# EasyEDA schematic 1-Schematic_Cowboy-key.json
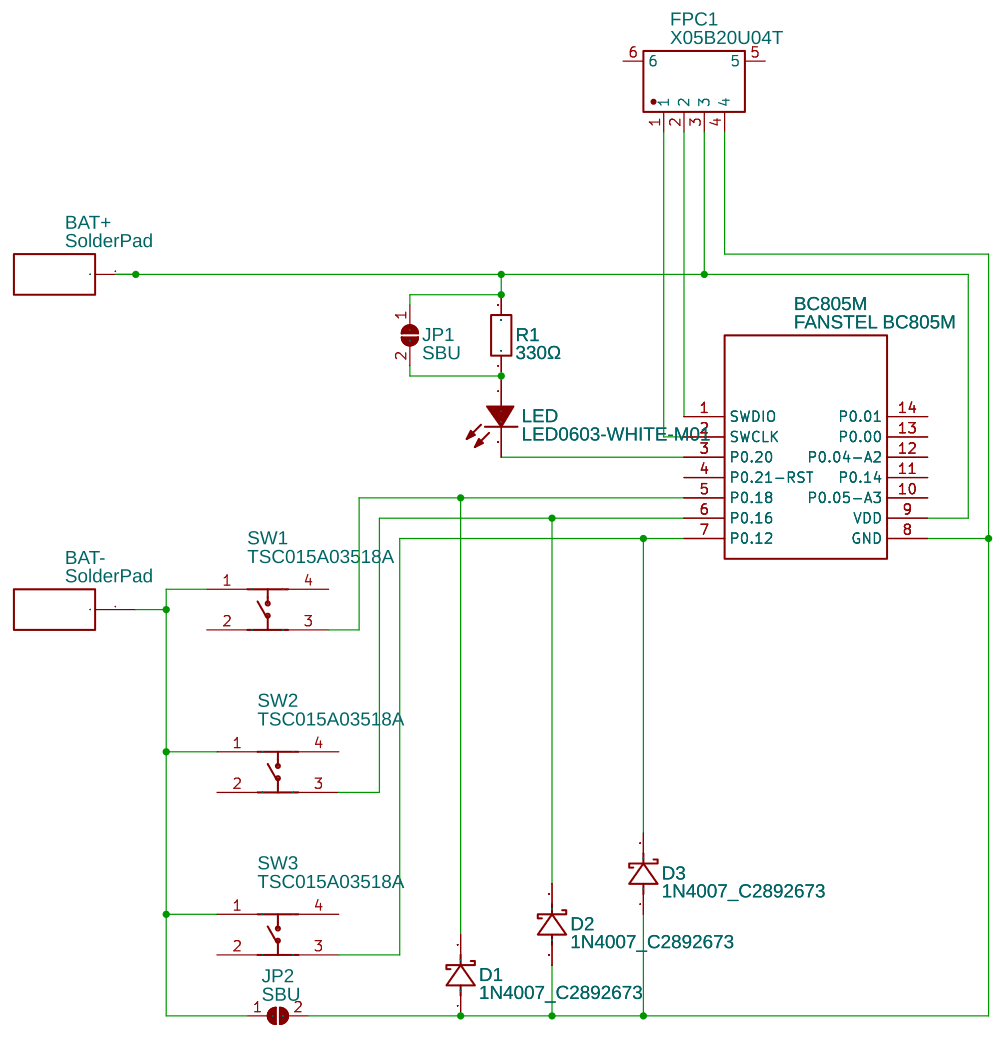
[diagram p0: schematic sheet]

## Parts
BAT+  SolderPad  [SOLDERPAD]
BAT-  SolderPad  [SOLDERPAD]
BC805M  FANSTEL BC805M  [FANSTEL BC805M]
D1  1N4007_C2892673  [SMA_L4.3-W2.6-LS5.1-R-RD]
D2  1N4007_C2892673  [SMA_L4.3-W2.6-LS5.1-R-RD]
D3  1N4007_C2892673  [SMA_L4.3-W2.6-LS5.1-R-RD]
FPC1  X05B20U04T  [FFC-SMD_4P-P0.50_X05B20U04T]
JP1  SBU  [SOLDER BRIDGE 2P UNBRIDGED]
JP2  SBU  [SOLDER BRIDGE 2P UNBRIDGED]
LED  LED0603-WHITE-M01  [LED0603-WHITE-M01]
R1  330Ω  [R0603]
SW1  TSC015A03518A  [KEY-SMD_4P-L4.5-W4.5-P3.00-LS6.8]
SW2  TSC015A03518A  [KEY-SMD_4P-L4.5-W4.5-P3.00-LS6.8]
SW3  TSC015A03518A  [KEY-SMD_4P-L4.5-W4.5-P3.00-LS6.8]

## Library data of the parts
BAT+ BAT- = SolderPad: Contributor: bribri.barth; Package Display: No
BC805M = FANSTEL BC805M: Manufacturer: Fanstel; link: https://www.fanstel.com/bc805; Contributor: rory bladen; Package Display: No
D1-D3 = 1N4007_C2892673: Supplier: LCSC; Supplier Part: C2892673; Manufacturer: YONGYUTAI(永裕泰); Manufacturer Part: 1N4007; Contributor: LCSC; JLCPCB Part Class: Extended Part
FPC1 = X05B20U04T: Supplier: LCSC; Supplier Part: C388690; Manufacturer: XKB Connectivity(中国星坤); Contributor: LCSC; JLCPCB Part Class: Extended Part
JP1 JP2 = SBU: Contributor: RonNovy; Manufacturer Part: DNP; Manufacturer: DNP
LED = LED0603-WHITE-M01: Supplier: LCSC; Manufacturer: LITEON; Manufacturer Part: LTW-C191TS5; Contributor: Misal; Supplier Part: C125123; JLCPCB Part Class: Extended Part
R1 = SCR0603F330R: Supplier: LCSC; Supplier Part: C3016255; Manufacturer: VO(翔胜); Contributor: lcsc; JLCPCB Part Class: Extended Part
SW1-SW3 = TSC015A03518A: Supplier: LCSC; Supplier Part: C2888502; Manufacturer: BZCN(博众电气); Contributor: LCSC; JLCPCB Part Class: Extended Part

## Nets
Net-(BAT+-1): BAT+.1 BC805M.9(VDD) FPC1.3 JP1.1(A) R1.2
Net-(BAT--1): BAT-.1 JP2.1(A) SW1.1 SW2.1 SW3.1
Net-(BC805M-1): BC805M.1(SWDIO) FPC1.2
Net-(BC805M-2): BC805M.2(SWCLK) FPC1.1
Net-(BC805M-3): BC805M.3(P0.20) LED.2(K)
Net-(BC805M-5): BC805M.5(P0.18) D1.2(K) SW1.3
Net-(BC805M-6): BC805M.6(P0.16) D2.2(K) SW2.3
Net-(BC805M-7): BC805M.7(P0.12) D3.2(K) SW3.3
Net-(BC805M-8): BC805M.8(GND) D1.1(A) D2.1(A) D3.1(A) FPC1.4 JP2.2(B)
Net-(JP1-2): JP1.2(B) LED.1(A) R1.1

Not connected (* = marked no-connect by the designer): BC805M 4(P0.21-RST) 10(P0.05-A3) 11(P0.14) 12(P0.04-A2) 13(P0.00) 14(P0.01); FPC1 5 6; SW1 2 4; SW2 2 4; SW3 2 4
